# EAGLE design AEMLIC V3 (EAGLE 9.6.2)
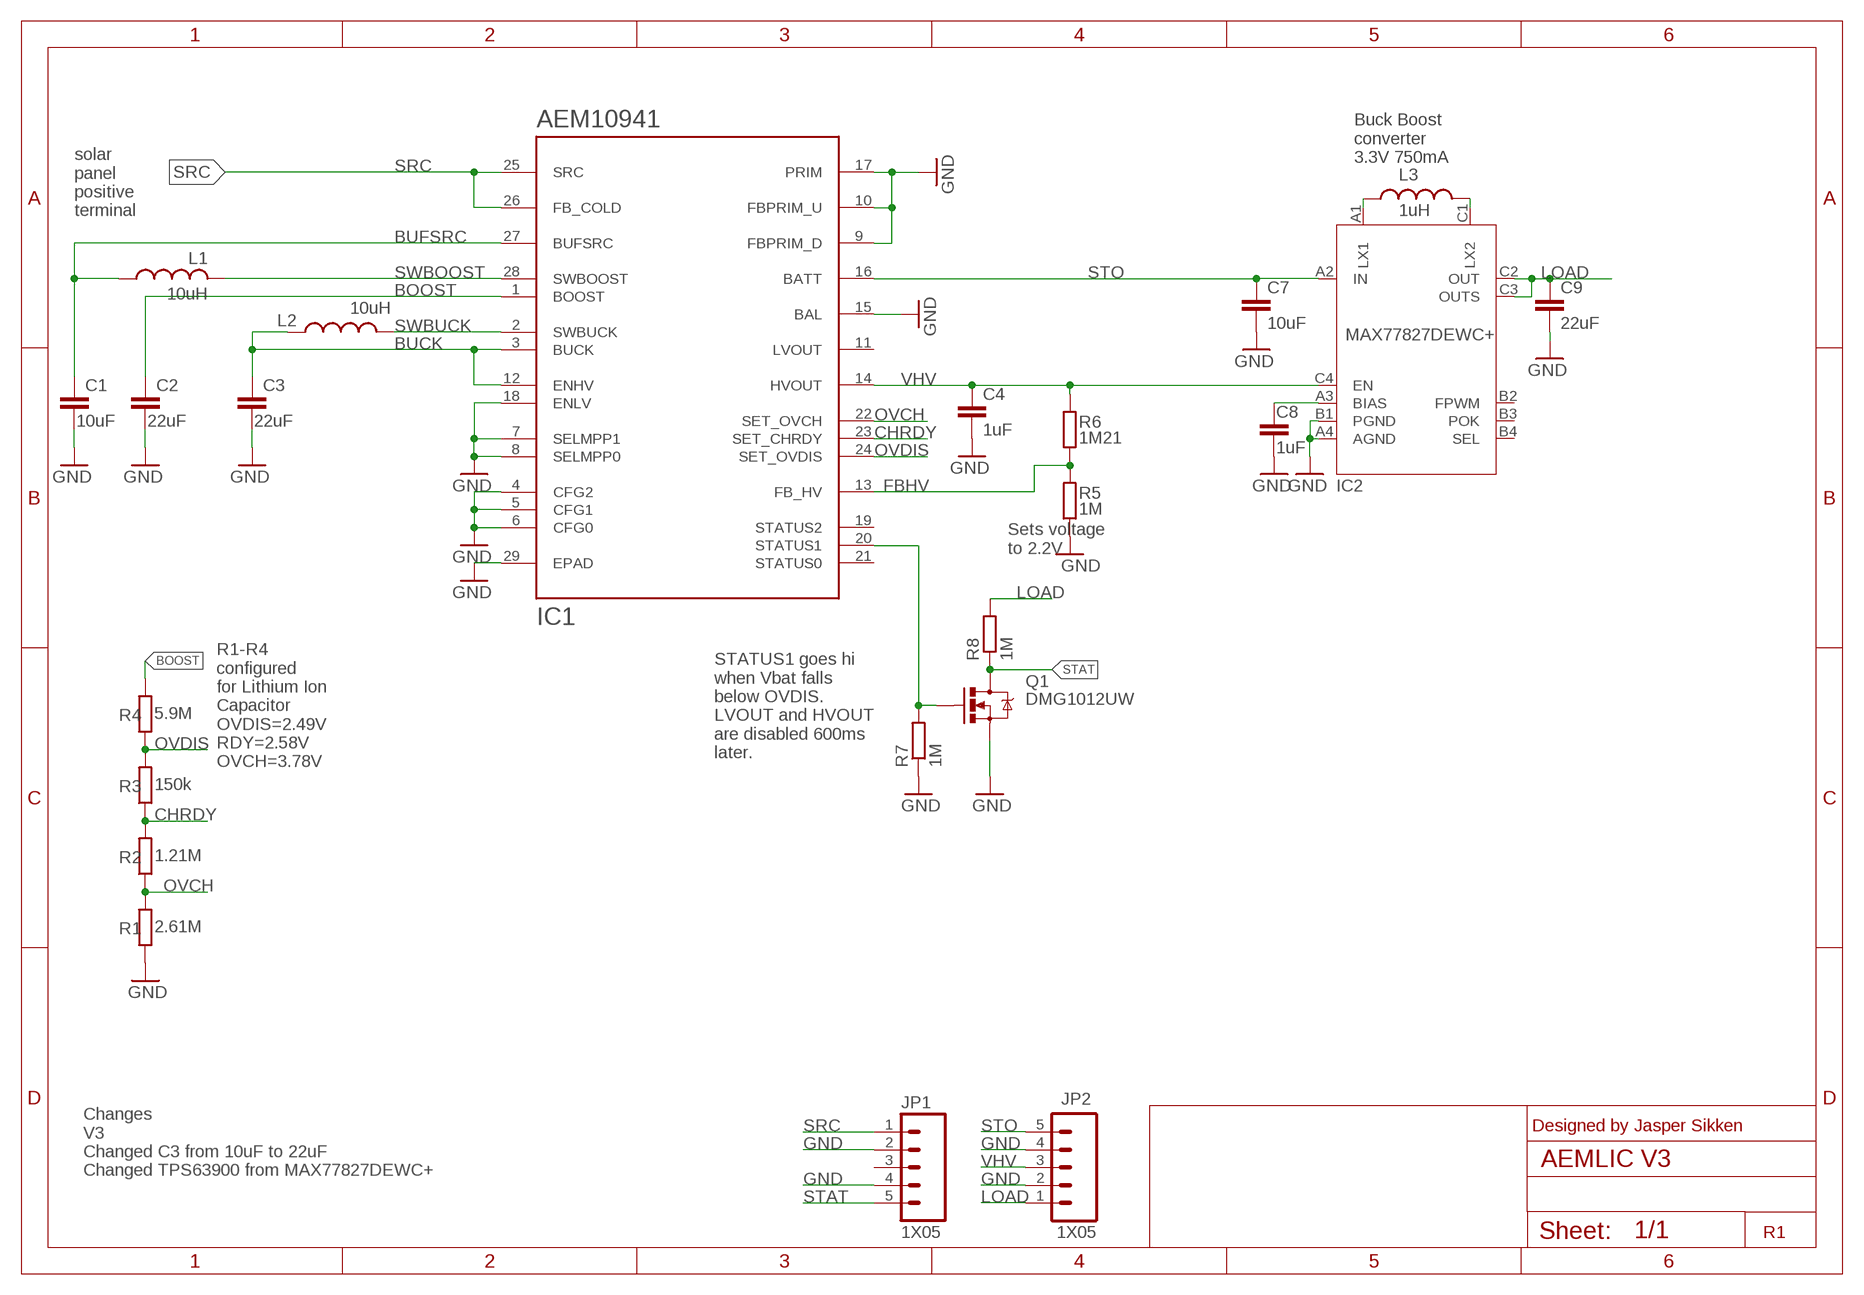
[diagram p0: schematic, sheet 1]

## Parts
C1  10uF  C0603_10UF  [C0603]
C2  22uF  C0603_22UF  [C0603]
C3  22uF  C0603_10UF  [C0603]
C4  1uF  C0603_10UF  [C0603]
C7  10uF  C0603_10UF  [C0603]
C8  1uF  C0603_1UF  [C0603]
C9  22uF  C0603_22UF  [C0603]
IC1  AEM10941  [QFN50P505X505X90-28]
IC2  MAX77827DEWC+  [WLP-12P-0.4PITCH]
JP1  1X05  [1X05_2.54MM_ROUND_NOSILK]
JP2  1X05  [1X05_2.54MM_ROUND_NOSILK]
L1  10uH  L3X3  [L_74404032100]
L2  10uH  L0603_10UH  [L0603]
L3  1uH  L3  [L_1008_[2520]]
Q1  DMG1012UW  MOSFET-N-CHANNEL_DMG1012UW  [SOT323]
R1  2.61M  R0402_1M  [R0402]
R2  1.21M  R0402_1M  [R0402]
R3  150k  R0402_1M  [R0402]
R4  5.9M  R0402_1M  [R0402]
R5  1M  R0402_1M  [R0402]
R6  1M21  R0402_1M  [R0402]
R7  1M  R0402_1M  [R0402]
R8  1M  R0402_1M  [R0402]

## Nets
BOOST: C2.1 IC1.1(BOOST) R4.2
BUCK: C3.1 IC1.3(BUCK) IC1.12(ENHV) L2.1
BUFSRC: C1.1 IC1.27(BUFSRC) L1.1
CHRDY: IC1.23(SET_CHRDY) R2.2 R3.1
FBHV: IC1.13(FB_HV) R5.2 R6.1
GND: C1.2 C2.2 C3.2 C4.2 C7.2 C8.2 C9.2 IC1.4(CFG2) IC1.5(CFG1) IC1.6(CFG0) IC1.7(SELMPP1) IC1.8(SELMPP0) IC1.9(FBPRIM_D) IC1.10(FBPRIM_U) IC1.15(BAL) IC1.17(PRIM) IC1.18(ENLV) IC1.29(EPAD) IC2.A4(AGND) IC2.B1(PGND) JP1.2 JP1.4 JP2.2 JP2.4 Q1.2(S) R1.1 R5.1 R7.1
LOAD: C9.1 IC2.C2(OUT) IC2.C3(OUTS) JP2.1 R8.2
LX1: IC2.A1(LX1) L3.2
LX2: IC2.C1(LX2) L3.1
N$4: C8.1 IC2.A3(BIAS)
OVCH: IC1.22(SET_OVCH) R1.2 R2.1
OVDIS: IC1.24(SET_OVDIS) R3.2 R4.1
SRC: IC1.25(SRC) IC1.26(FB_COLD) JP1.1
STAT: JP1.5 Q1.3(D) R8.1
STATUS1: IC1.20(STATUS1) Q1.1(G) R7.2
STO: C7.1 IC1.16(BATT) IC2.A2(IN) JP2.5
SWBOOST: IC1.28(SWBOOST) L1.2
SWBUCK: IC1.2(SWBUCK) L2.2
VHV: C4.1 IC1.14(HVOUT) IC2.C4(EN) JP2.3 R6.2
Unconnected: IC1.11(LVOUT) IC1.19(STATUS2) IC1.21(STATUS0) IC2.B2(FPWM) IC2.B3(POK) IC2.B4(SEL) JP1.3

## Notes on the sheet
- Buck Boost 
  converter
  3.3V 750mA
- solar
  panel
  positive
  terminal
- Sets voltage 
  to 2.2V
- STATUS1 goes hi 
  when Vbat falls 
  below OVDIS. 
  LVOUT and HVOUT
  are disabled 600ms
  later.
- R1-R4 
  configured 
  for Lithium Ion 
  Capacitor
  OVDIS=2.49V
  RDY=2.58V
  OVCH=3.78V
- Designed by Jasper Sikken
- Changes
  V3 
  Changed C3 from 10uF to 22uF
  Changed TPS63900 from MAX77827DEWC+
- R1

## Library data of the parts
C1 = TSEM:C: Non-polarized capacitor; FARNELL_OC: 2113070; MF: KEYSTONE; MPN: 1049P; OC_NEWARK: 53Y2625
C2 = TSEM:C: Non-polarized capacitor; FARNELL_OC: 2426957; MF: TDK; MPN: CGA5L1X7S1A226M160AC; OC_NEWARK: 71AH2845; VALUE: 22uF 10V
C3 = TSEM:C: Non-polarized capacitor; FARNELL_OC: 2113070; MF: KEYSTONE; MPN: 1049P; OC_NEWARK: 53Y2625; VALUE: 10uF
C4 = TSEM:C: Non-polarized capacitor; FARNELL_OC: 2113070; MF: Taiyo Yuden; MPN: LMK107BBJ106MALT; VALUE: 10uF
C7 = TSEM:C: Non-polarized capacitor; FARNELL_OC: 2113070; MF: Taiyo Yuden; MPN: LMK107BBJ106MALT
C8 = JaspersEagleLibrary:C: Non-polarized capacitor; FARNELL_OC: 1759398
C9 = TSEM:C: Non-polarized capacitor; FARNELL_OC: 2426957; MF: Murata; MPN: GRM188R61A226ME15D; VALUE: 22uF 10V
IC1 = TSEM:AEM10941: Ambient Energy Manager from e-peas; OC_NEWARK: unknown
IC2 = JaspersEagleLibrary:MAX77827: 5.5V Input, 1.8A/3.1A Switch Buck-Boost Converter with 6μA IQ; MANUFACTURER: Maxim Integrated; MPN: MAX77827DEWC+T
JP1 JP2 = TSEM:1X05; OC_NEWARK: unknown
L1 = JaspersEagleLibrary:L: Inductor; MF: Wurth; MPN: 74404032100
L2 = TSEM:L: Inductor; FARNELL_OC: 2215635; MF: TAIYO YUDEN; MPN: CK2125100M-T; OC_NEWARK: 25AC6883
L3 = JaspersEagleLibrary:L: Inductor; MF: murata; MPN: DFE252012F-1R0M#
Q1 = TSEM:MOSFET-N-CHANNEL: Mosfet N channel; FARNELL_OC: 2061403; OC_NEWARK: unknown
R1-R4 R6 = TSEM:R: Resistor; FARNELL_OC: 2502499; OC_NEWARK: unknown; VALUE: 1M
R5 R7 R8 = TSEM:R: Resistor; FARNELL_OC: 2502499; OC_NEWARK: unknown

## Board
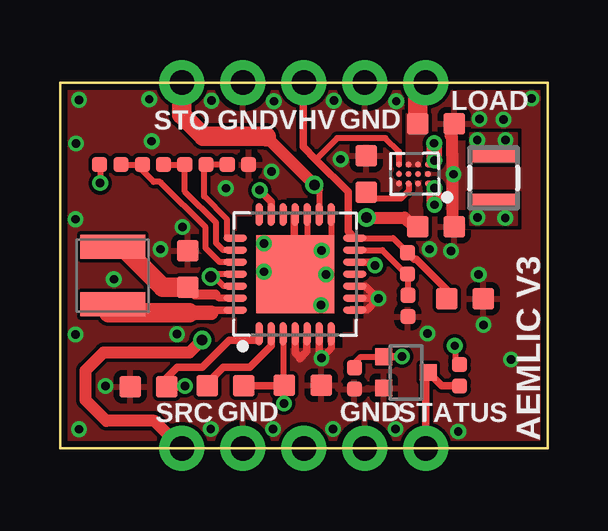
[diagram p1: board, top side]
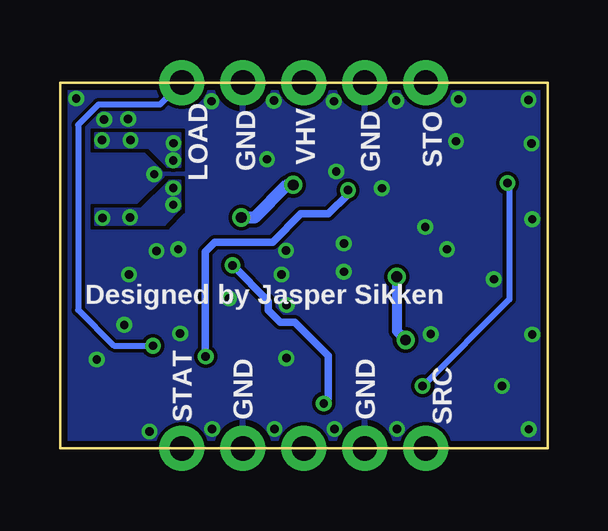
[diagram p2: board, bottom side, seen from below]

Size 20.32 x 15.24 mm. Coordinates in mm from the lower left corner, seen from the top.
Outline: 0,0 0,15.24 20.32,15.24 20.32,0 0,0
Copper layers (1*16): Top 0.035mm / dielectric 1.6mm / Bottom 0.035mm
Design rules "Elecrow_2-layer_PCB_eagle_rule *": minimum track width 6mil, minimum drill 12mil, track to track 0.15mm, track to pad 0.15mm, pad to pad 0.15mm, via to via 8mil, smd to smd 0mil, copper to edge 10mil, drill to drill 10mil, minimum pad ring 6mil, minimum via ring 6mil, stop-mask expansion 0mil, vias tented up to drill 100mil, thermal gap 10mil
tRestrict: area 12.2,5.4 to 12.6,7.1; area 9.6,4.2 to 10.7,5.2; area 11,9.5 to 11.6,10.3; area 10.7,4.2 to 11.8,5.2; area 9.4,9.3 to 10.5,10.4

### Footprints (pad centres in the part's own frame; a part is rotated, then mirrored left to right if it is on the bottom)
C0603 = smd 0.889 x 0.889: 1 -0.762,0; 2 0.762,0
QFN50P505X505X90-28 = smd 0.977 x 0.292: 1 -2.486,1.5; 2 -2.486,1; 3 -2.486,0.5; 4 -2.486,0; 5 -2.486,-0.5; 6 -2.486,-1; 7 -2.486,-1.5; 15 2.486,-1.5; 16 2.486,-1; 17 2.486,-0.5; 18 2.486,0; 19 2.486,0.5; 20 2.486,1; 21 2.486,1.5 | smd 0.292 x 0.977: 8 -1.5,-2.486; 9 -1,-2.486; 10 -0.5,-2.486; 11 0,-2.486; 12 0.5,-2.486; 13 1,-2.486; 14 1.5,-2.486; 22 1.5,2.486; 23 1,2.486; 24 0.5,2.486; 25 0,2.486; 26 -0.5,2.486; 27 -1,2.486; 28 -1.5,2.486 | smd 3.25 x 3.25: 29 0,0
WLP-12P-0.4PITCH = smd 0.25 x 0.25: A1 -0.6,0.4; A2 -0.2,0.4; A3 0.2,0.4; A4 0.6,0.4; B1 -0.6,0; B2 -0.2,0; B3 0.2,0; B4 0.6,0; C1 -0.6,-0.4; C2 -0.2,-0.4; C3 0.2,-0.4; C4 0.6,-0.4
1X05_2.54MM_ROUND_NOSILK = drill 1.016 pad 1.88: 1 0,0; 2 2.54,0; 3 5.08,0; 4 7.62,0; 5 10.16,0
L_74404032100 = smd 2.7 x 1: 1 0,1.2; 2 0,-1.2
L0603 = smd 0.889 x 0.889: 1 -0.762,0; 2 0.762,0
L_1008_[2520] = smd 0.6 x 2: 1 -0.95,0; 2 0.95,0
SOT323 = smd 0.7 x 0.7: 1 -0.65,-0.925; 2 0.65,-0.925; 3 0,0.925
R0402 = smd 0.635 x 0.635: 1 -0.445,0; 2 0.445,0

### Placement (x,y rotation side)
C1  5.32,7.47 90 top
C2  3.69,2.58 180 top
C3  10.12,2.63 0 top
C4  16.88,6.22 0 top
C7  15.68,9.22 0 top
C8  12.77,11.44 90 top
C9  15.68,13.53 0 top
IC1  9.79,7.25 90 top
IC2  14.72,11.44 180 top
JP1  5.08,0 0 top
JP2  15.24,15.24 180 top
L1  2.2,7.2 0 top
L2  6.89,2.62 180 top
L3  18.07,11.27 270 top
Q1  14.41,3.16 270 top
R1  7.42,11.82 180 top
R2  5.64,11.82 180 top
R3  3.88,11.82 180 top
R4  2.1,11.82 180 top
R5  14.49,5.93 90 top
R6  14.48,7.71 90 top
R7  12.27,2.92 90 top
R8  16.65,3.04 90 top

### Tracks (layer width: path | path; a pad name or v marks a point on that pad's centre or on a via)
BOOST  (via drill 0.35 pad 0.65)
  Top 0.25: R4.2 1.68,11.8 v1.68,11.05
  Top 0.305: v5.21,2.6 5.19,2.58 C2.1 4.45,2.95 4.88,3.38 5.92,3.38 7.05,4.5 8.29,4.5 IC1.1
  Bottom 0.254: v5.21,2.6 1.6,6.21 1.6,10.97 v1.68,11.05
BUCK  (via drill 0.35 pad 0.65)
  Top 0.25: IC1.3 9.29,2.69 C3.1
  Top 0.305: v13.13,7.62 13.13,7.75 IC1.12 | v9.33,1.87 9.33,2.61 C3.1 | L2.1 9.22,2.62 9.29,2.69
  Bottom 0.305: v9.33,1.87 9.14,2.06 9.14,3.85 10.55,5.25 11.15,5.25 11.64,5.75 11.64,6.13 v13.13,7.62
BUFSRC
  Top 0.3: IC1.27 6.62,6.25 6.47,6.41
  Top 0.305: L1.1 2.58,8.4 2.61,8.37
  Top 0.406: 6.47,6.41 5.62,6.41 C1.1
  Top 0.813: 2.61,8.37 4.28,6.71 C1.1
CHRDY
  Top 0.254: IC1.23 6.8,8.26 6.5,8.55 6.5,9.4 5.2,10.7 R2.2 | R2.2 | R3.1 R2.2
FBHV
  Top 0.254: IC1.13 13.43,8.26 14.43,7.26 | R6.1 14.49,7.25 R5.2
  Top 0.305: R6.1 14.43,7.26
GND  (via drill 0.35 pad 0.65)
  Top 0.152: v8.49,7.36 8.77,7.36 9.24,7.83 9.62,7.45 9.62,7.43 IC1.29 9.79,7.08
  Top 0.254: IC1.15 11.29,8.76 10.9,8.37 v10.9,8.24 | 9.62,7.43 9.62,7.84 10.32,8.54 10.29,8.57 IC1.17
  Top 0.3: IC1.7 11.29,4.16 v10.89,3.75
  Top 0.305: 10.62,6.25 9.79,7.08 | IC1.4 9.79,3.98 9.98,3.79 9.98,3.73 10.29,4.04 IC1.5 | IC1.6 10.79,3.86 10.89,3.76 v10.89,3.75 | IC1.18 9.77,9.72 9.77,8.79 9.52,8.53 v8.49,8.53 | IC1.10 12.72,6.75 13.23,6.25 v13.27,6.25 | IC1.9 v13.26,6.25 v13.27,6.25 | v13.27,6.25 12.8,5.78 12.13,5.78 12.15,5.75 IC1.8
  Top 0.508: v10.9,8.24 9.91,7.25 IC1.29 | C9.2 16.26,13.35 16.26,13.04 16.33,12.98 16.33,12.25 16.35,12.22 16.35,9.31 C7.2
  other vias: 10.88,5.97 11.09,7.25 6.91,10.84 1.9,2.6 4.87,4.75 4.19,8.29 5.1,9.22 8.91,14.46 6.31,14.48 11.41,14.48 14.01,14.46 6.28,0.81 8.88,0.81 11.38,0.81 13.98,0.81 17.64,5.14 15.31,4.79 17.44,7.25 15.39,8.29 11.69,12.04 19.64,14.57 16.39,11.42 16.59,0.69 17.48,13.72 16.29,8.22 0.79,14.52 0.67,12.7 3.82,12.79 3.72,14.54 18.48,13.7 8.81,11.54 0.79,0.8 18.79,3.69 2.24,7.04 0.64,9.54 0.64,4.75
  pour Top (rank 2): 0,15.24 20.32,15.24 20.32,0 0,0
  pour Bottom (rank 2): 0,15.24 20.32,15.24 20.32,0 0,0
LOAD  (via drill 0.35)
  Top 0.254: R8.2 16.47,3.66 16.47,4.25 v16.45,4.28
  Top 0.813: JP2.1 14.91,14.91 C9.1
  Bottom 0.25: JP2.1 16.16,14.32 18.73,14.32 19.57,13.48 19.57,5.77 18.07,4.28 v16.45,4.28
  pour Top (no thermals): 14.45,11.75 15.25,11.75 15.25,13.93 14.45,13.93
LX1  (via drill 0.35 pad 0.65)
  Top 0.25: IC2.A1 15.45,11.04 15.6,10.88 v15.6,10.85
  Top 0.65: v15.6,10.85 v15.6,10.15
  other vias: 17.4,9.62 18.55,9.6
  pour Bottom: 15.3,11.15 15.78,11.15 16.95,9.97 18.85,9.97 18.85,9.32 15.95,9.32 15.3,9.97
  pour Top (no thermals): 17.1,10.53 17.1,9.32 19.02,9.32 19.02,10.53
LX2  (via drill 0.35 pad 0.65)
  Top 0.25: IC2.C1 15.5,11.84 15.6,11.94 v15.6,12
  Top 0.65: v15.59,12.71 v15.59,12.01 v15.6,12
  other vias: 18.57,12.84 17.39,12.84
  pour Bottom: 15.3,11.72 15.85,11.72 16.65,12.53 18.85,12.53 18.85,13.12 15.3,13.12
  pour Top (no thermals): 17.1,11.93 19.02,11.93 19.02,13.12 17.1,13.12
N$4
  Top 0.25: IC2.A3 14.53,10.72 14.2,10.4 13.04,10.4 C8.1
OVCH
  Top 0.25: 6.96,9.54 6,10.5 6,11.74 R2.1
  Top 0.254: 6.96,9.54 6.96,8.79 6.99,8.76 IC1.22 | R1.2 R2.1
OVDIS
  Top 0.25: 7.27,7.75 6.66,7.75 | R4.1 R3.2 3.4,11.79 3.4,11.6 3.9,11.1 4.17,11.1 4.2,11.07
  Top 0.254: 6.66,7.75 6.07,8.34 6.07,9.21 4.2,11.07 | IC1.24 7.27,7.75
SRC  (via drill 0.45 pad 0.75)
  Top 0.254: IC1.26 6.83,6.75 6.43,7.15 v6.29,7.15 6.39,7.25 IC1.25
  Top 0.508: v5.92,4.51 5.4,4 1.82,4 1.07,3.25 1.07,2 1.93,1.15 3.94,1.15 JP1.1
  Bottom 0.406: v6.29,7.15 6.29,4.88 v5.92,4.51
STAT
  Top 0.305: JP1.5 15.24,3.06 Q1.3 15.9,2.6 R8.1
STATUS1  (via drill 0.35 pad 0.65)
  Top 0.254: R7.2 12.27,3.53 12.54,3.81 Q1.1
  Top 0.305: IC1.20 8.79,10.28 v8.32,10.76 | v14.25,3.83 13.33,3.83 Q1.1
  Bottom 0.305: v8.32,10.76 8.32,10.6 9.15,9.77 10.28,9.77 11.45,8.6 13.87,8.6 14.28,8.19 14.28,3.85 v14.25,3.83
STO  (via drill 0.45 pad 0.75)
  Top 0.254: 10.79,10.78 IC1.16
  Top 0.305: 10.79,10.78 v10.6,10.97
  Top 0.508: v10.6,10.97 8.6,12.97 | C7.1 14.74,9.22 14.35,9.62 v12.77,9.62
  Top 0.813: 8.6,12.97 8.57,13 5.97,13 5.08,13.9 5.08,14.53 5.08,14.54 JP2.5
  Bottom 0.508: v10.6,10.97 10.85,10.97 12.21,9.62 v12.77,9.62
  pour Top (no thermals): 14.6,11.18 14.6,10.78 14.57,10.75 14.57,8.93 15.1,8.93 15.1,11.18
SWBOOST
  Top 0.305: 2.02,5.64 2.04,5.78 2.2,5.95 L1.2 | IC1.28 6.42,5.75 6.3,5.64
  Top 0.61: 6.3,5.64 5.38,5.64
  Top 0.813: 5.38,5.64 2.02,5.64
SWBUCK
  Top 0.305: L2.2 6.04,2.62 6.8,3.38 7.9,3.38 8.79,4.27 IC1.2
VHV
  Top 0.25: IC2.C4 14.12,12.36 13.56,12.93 11.55,12.93 10.65,12.03
  Top 0.254: R6.2 13.88,8.76 IC1.14
  Top 0.305: JP2.3 10.13,15.27 10.13,12.55 10.65,12.03 12,10.69 12,9.04 IC1.14 | R6.2 14.75,7.88 14.84,7.88 16.11,6.6 C4.1

### Text on the board
tPlace: LOAD | STO | GND | VHV | GND | SRC | GND | GND | STATUS | AEMLIC V3
bPlace: STO | GND | VHV | GND | LOAD | Designed by Jasper Sikken | SRC | GND | GND | STAT